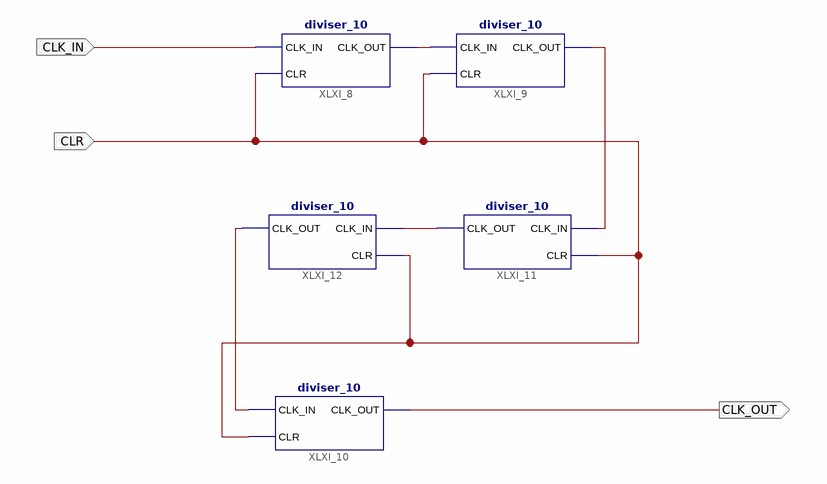
[diagram p0: schematic sheet 1]
// Xilinx ISE schematic diviser_100K.sch (spartan6) as structural Verilog: 5 symbols, 3 ports
module diviser_100K (
  input  CLK_IN,
  input  CLR,
  output CLK_OUT
);

  wire XLXN_1, XLXN_2, XLXN_3, XLXN_4;

  diviser_10 XLXI_8 (.CLK_IN(CLK_IN), .CLK_OUT(XLXN_1), .CLR(CLR));
  diviser_10 XLXI_9 (.CLK_IN(XLXN_1), .CLK_OUT(XLXN_3), .CLR(CLR));
  diviser_10 XLXI_10 (.CLK_IN(XLXN_4), .CLK_OUT(CLK_OUT), .CLR(CLR));
  diviser_10 XLXI_11 (.CLK_IN(XLXN_3), .CLK_OUT(XLXN_2), .CLR(CLR));
  diviser_10 XLXI_12 (.CLK_IN(XLXN_2), .CLK_OUT(XLXN_4), .CLR(CLR));
endmodule
